# EAGLE design Main (EAGLE 9.6.0)
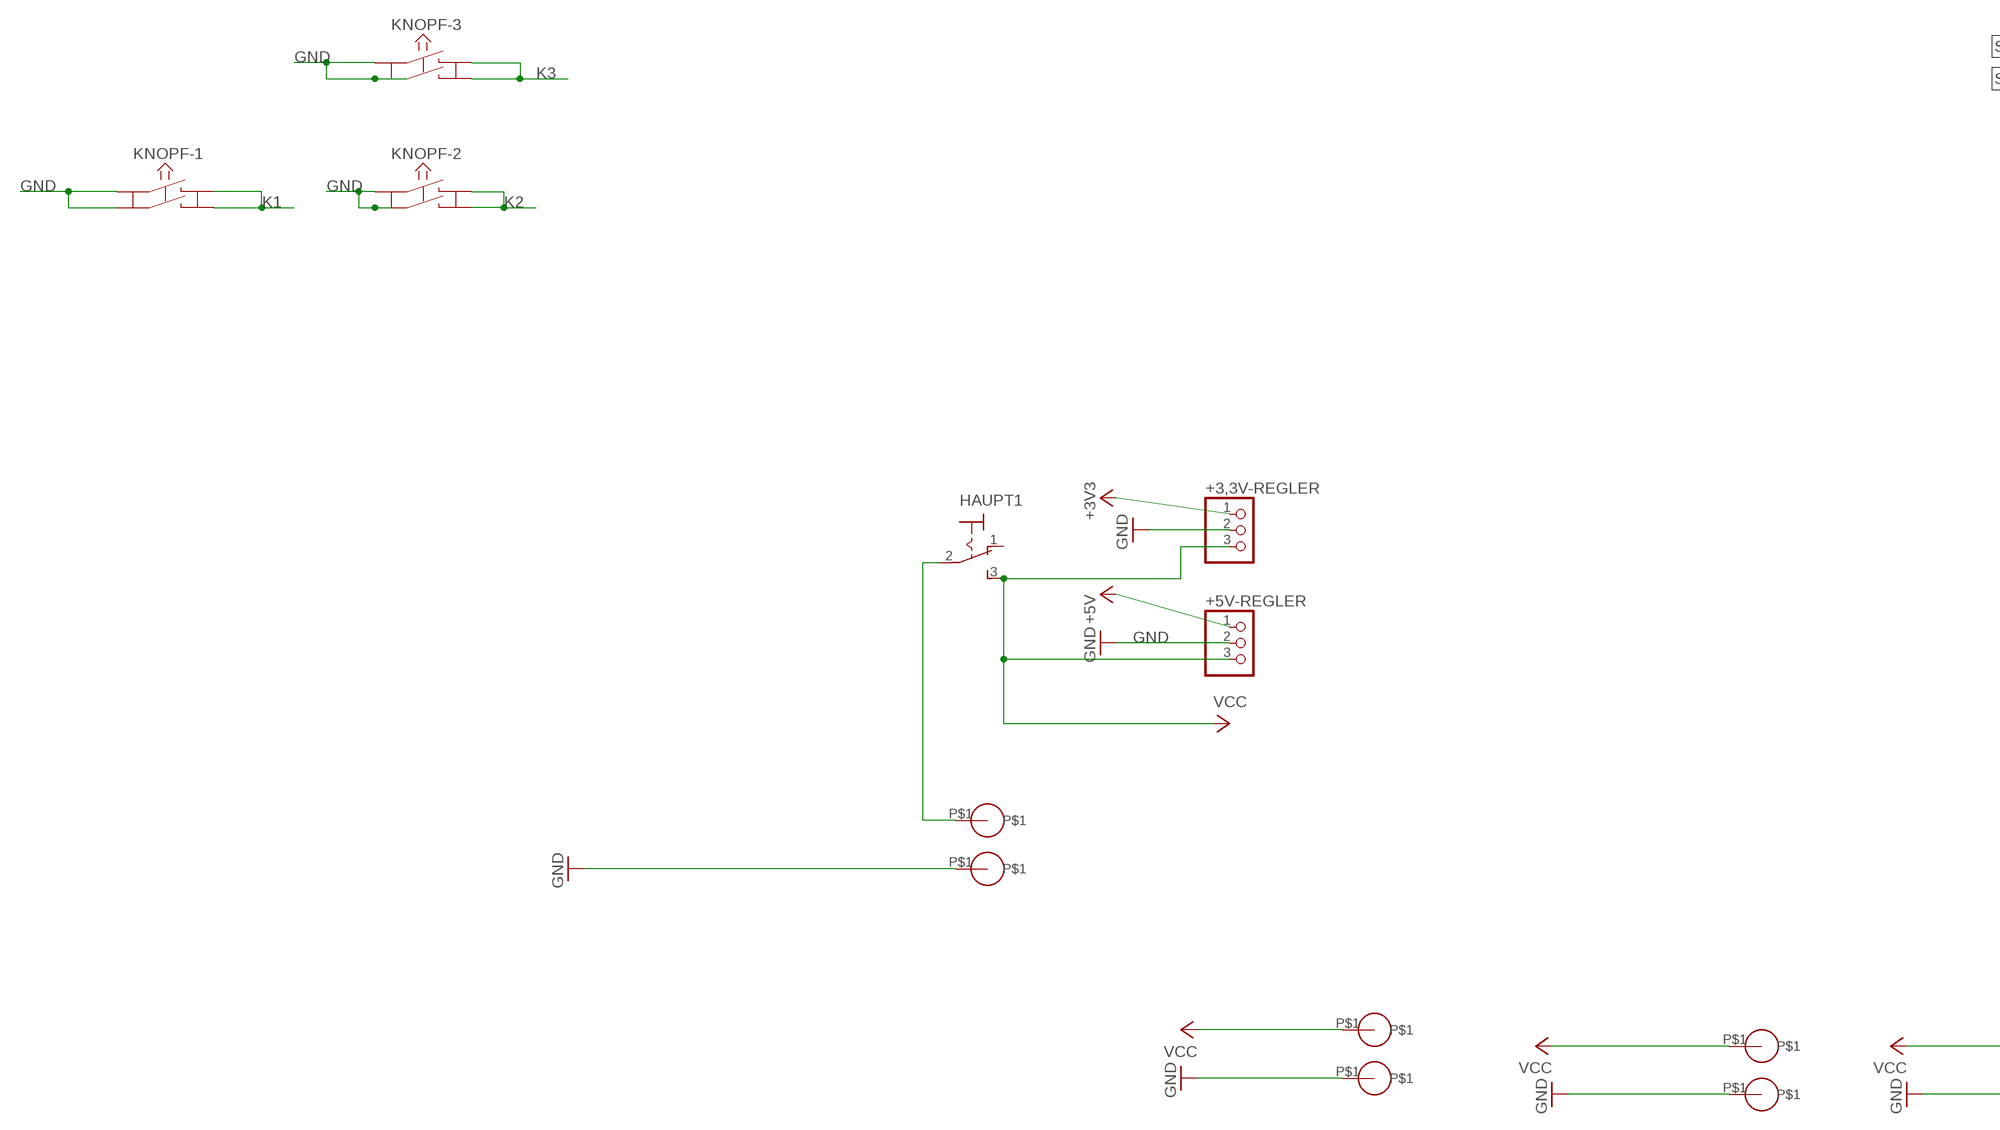
[diagram p0: schematic, sheet 1, part 1 of 3]
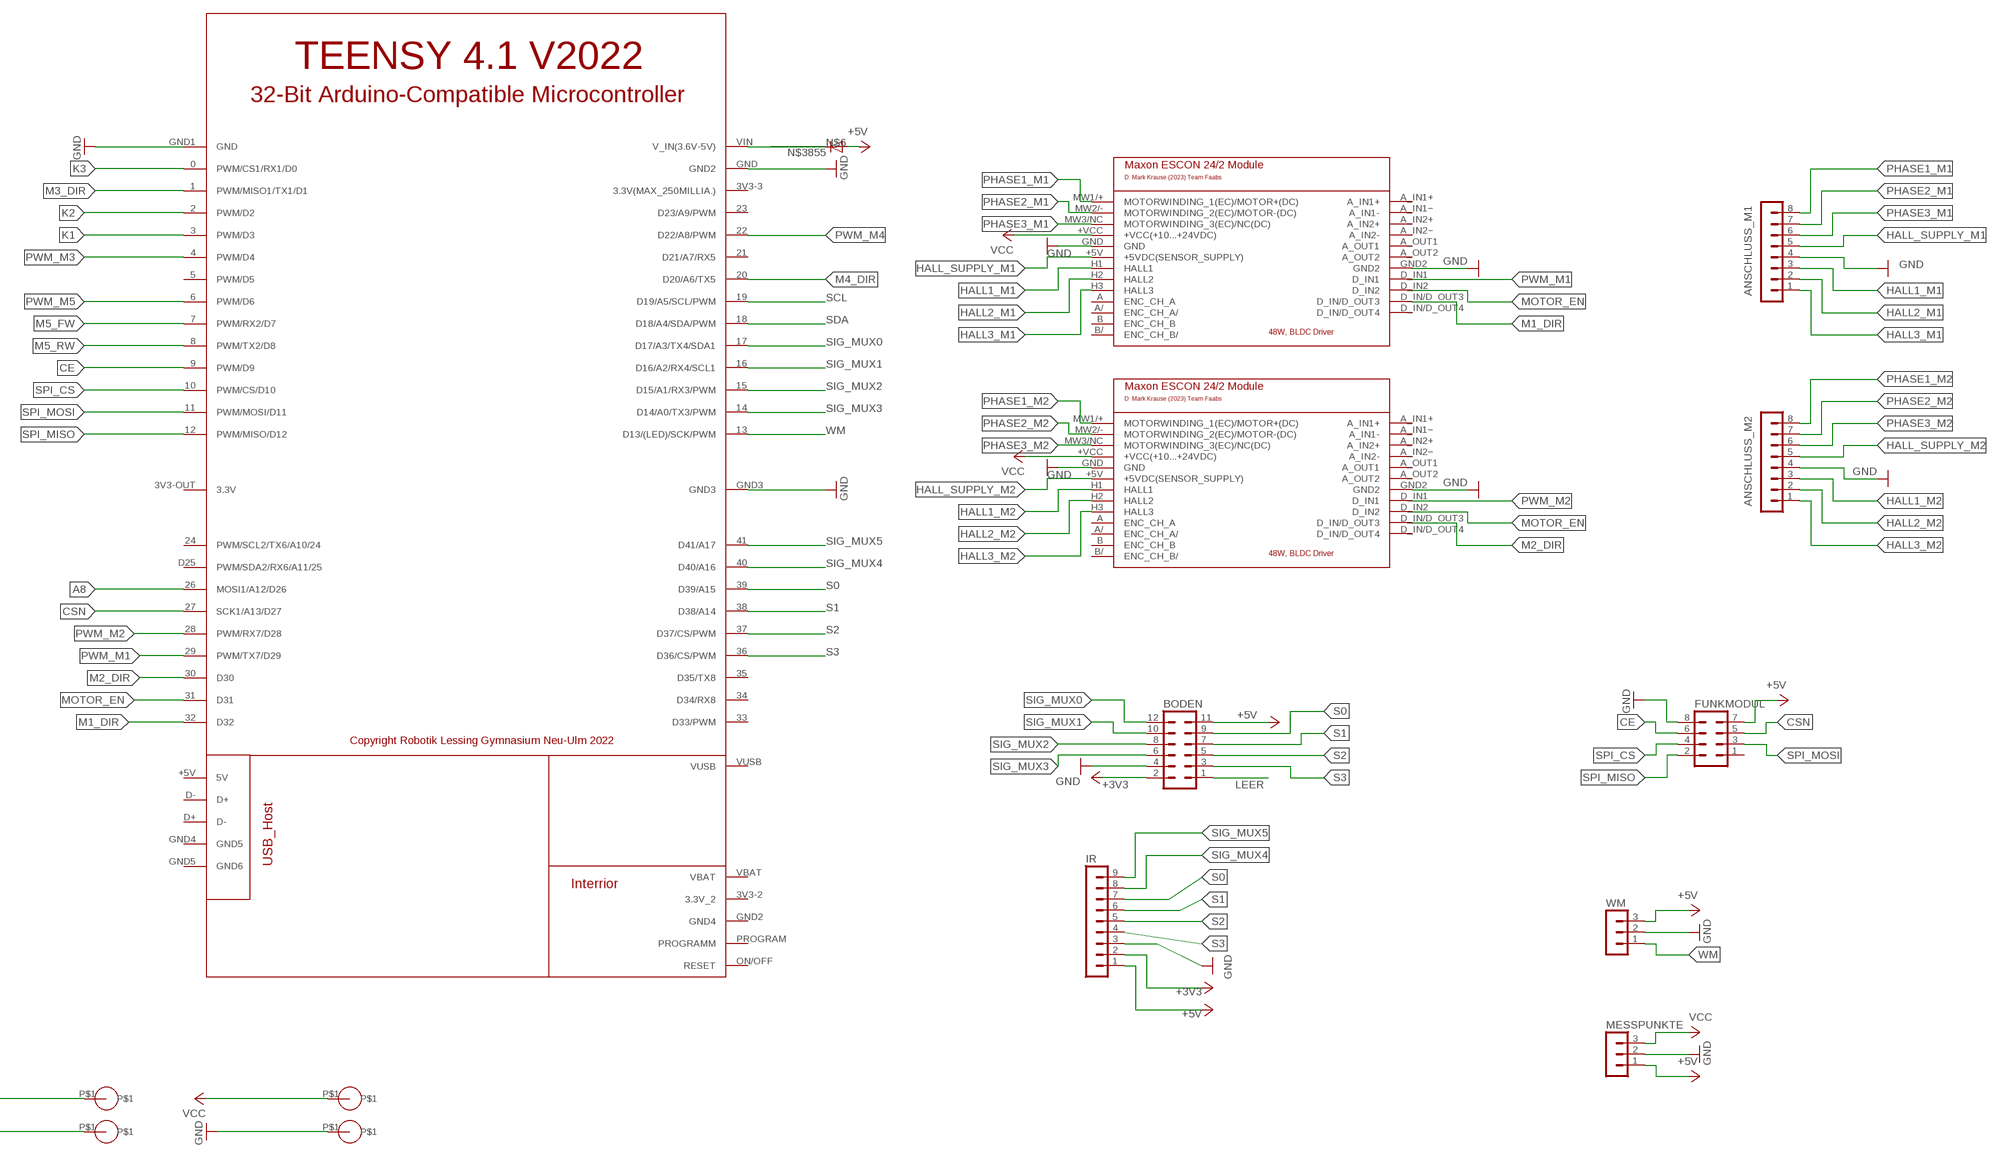
[diagram p1: schematic, sheet 1, part 2 of 3]
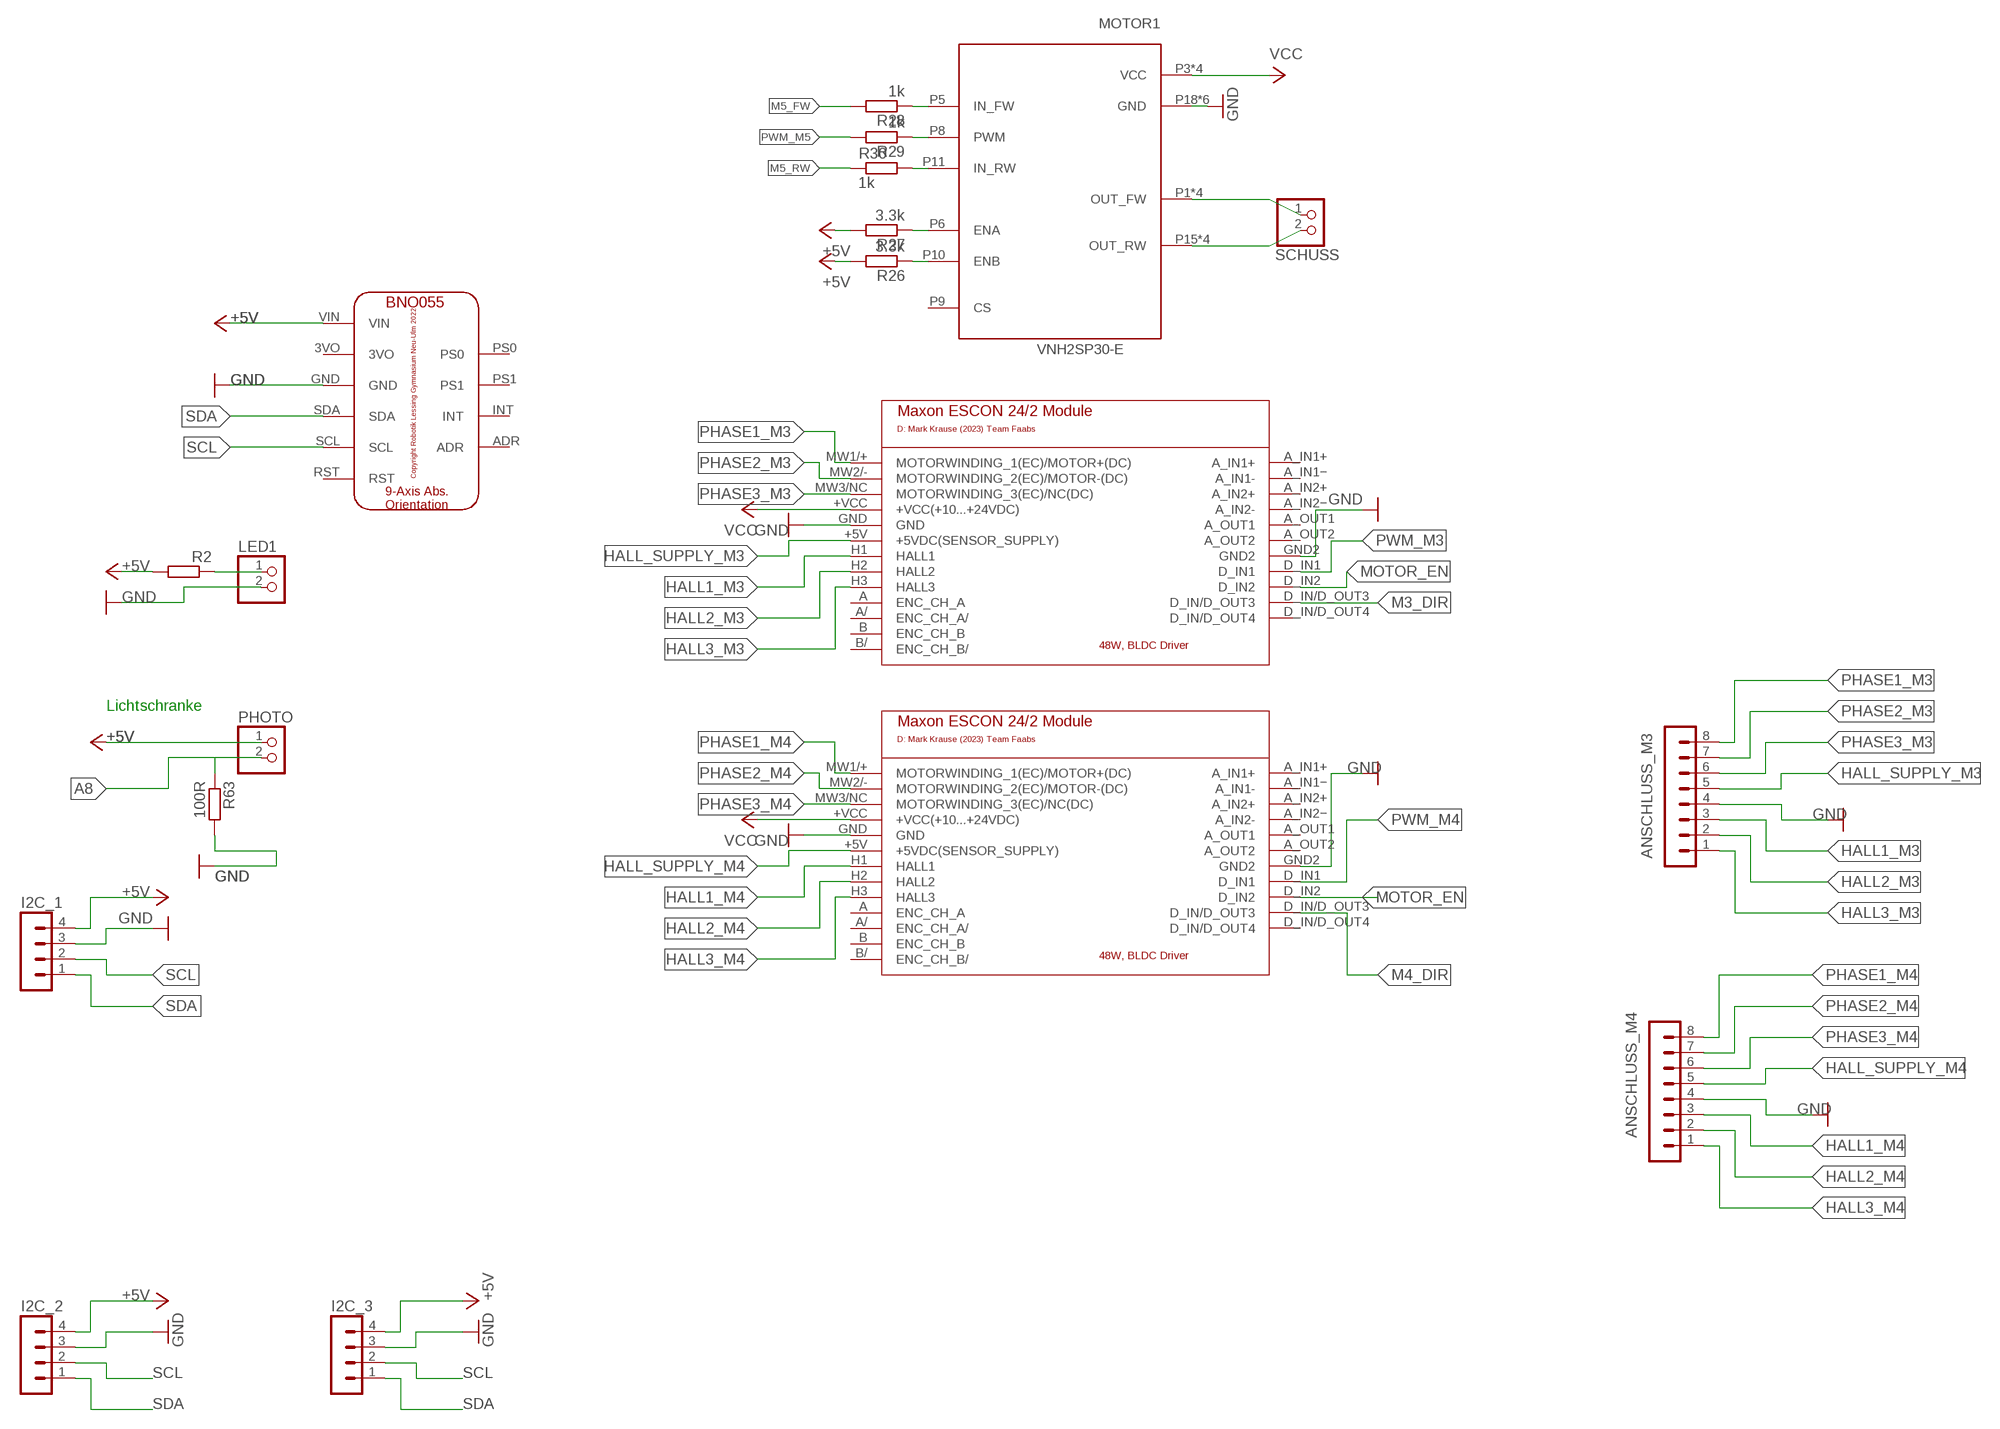
[diagram p2: schematic, sheet 1, part 3 of 3]

## Parts
+3,3V-REGLER  PINHD-1X3  [1X03]
+5V-REGLER  PINHD-1X3  [1X03]
ANSCHLUSS_M1  MA08-1  [MA08-1]
ANSCHLUSS_M2  MA08-1  [MA08-1]
ANSCHLUSS_M3  MA08-1  [MA08-1]
ANSCHLUSS_M4  MA08-1  [MA08-1]
BNO055  BNO055  [BNO055]
BODEN  MA06-2  [MA06-2]
FUNKMODUL  MA04-2  [MA04-2]
GND  PPAD  [PPAD]
GND10  PPAD  [PPAD]
GND11  PPAD  [PPAD]
GND35  PPAD  [PPAD]
GND37  PPAD  [PPAD]
HAUPT1  320-916  [320-916]
I2C_1  MA04-1  [MA04-1]
I2C_2  MA04-1  [MA04-1]
I2C_3  MA04-1  [MA04-1]
IR  MA09-1  [MA09-1]
KNOPF-1  KSM611A  [KSM611A]
KNOPF-2  KSM611A  [KSM611A]
KNOPF-3  KSM611A  [KSM611A]
LED1  PINHD-1X2  [1X02]
MAIN  PPAD  [PPAD]
MAIN1  PPAD  [PPAD]
MAIN2  PPAD  [PPAD]
MAIN3  PPAD  [PPAD]
MAIN4  PPAD  [PPAD]
MESSPUNKTE  MA03-1  [MA03-1]
MOTOR1  VNH2SP30-E  [MP-SO-30]
N$3855  DIODE-SMB  [SMB]
PHOTO  PINHD-1X2  [1X02]
R2  100R  R-EU_R1206  [R1206]
R26  3.3k  R-EU_R0805  [R0805]
R27  3.3k  R-EU_R0805  [R0805]
R28  1k  R-EU_R0805  [R0805]
R29  1k  R-EU_R0805  [R0805]
R30  1k  R-EU_R0805  [R0805]
R63  100R  R-EU_R0805  [R0805]
SCHUSS  PINHD-1X2  [1X02]
U$1  MAXON_ESCON24/2  [MAXON_ESCON24/2_MODULE]
U$2  TEENSY_4.1  [TEENSY_4.1]
U$3  MAXON_ESCON24/2  [MAXON_ESCON24/2_MODULE]
U$4  MAXON_ESCON24/2  [MAXON_ESCON24/2_MODULE]
U$5  MAXON_ESCON24/2  [MAXON_ESCON24/2_MODULE]
WM  MA03-1  [MA03-1]

## Nets
+3V3 [5v]: +3,3V-REGLER.1 BODEN.2 IR.2
+5V [5v]: +5V-REGLER.1 BNO055.VIN BODEN.11 FUNKMODUL.7 I2C_1.4 I2C_2.4 I2C_3.4 IR.1 MESSPUNKTE.1 N$3855.A PHOTO.1 R2.2 R26.2 R27.2 WM.3
A8: PHOTO.2 R63.1 U$2.26(MOSI1/A12/D26)
CE: FUNKMODUL.6 U$2.9(PWM/D9)
CSN: FUNKMODUL.5 U$2.27(SCK1/A13/D27)
GND: +3,3V-REGLER.2 +5V-REGLER.2 ANSCHLUSS_M1.4 ANSCHLUSS_M2.4 ANSCHLUSS_M3.4 ANSCHLUSS_M4.4 BNO055.GND BODEN.4 FUNKMODUL.8 GND10.P$1 GND11.P$1 GND35.P$1 GND37.P$1 GND.P$1 I2C_1.3 I2C_2.3 I2C_3.3 IR.3 KNOPF-1.A KNOPF-1.C KNOPF-2.A KNOPF-2.C KNOPF-3.A KNOPF-3.C LED1.2 MESSPUNKTE.2 MOTOR1.P18(GND) MOTOR1.P19(GND) MOTOR1.P20(GND) MOTOR1.P26(GND) MOTOR1.P27(GND) MOTOR1.P28(GND) R63.2 U$1.GND U$1.GND2 U$2.GND1(GND) U$2.GND3 U$2.GND(GND2) U$3.GND U$3.GND2 U$4.GND U$4.GND2 U$5.GND U$5.GND2 WM.2
HALL1_M1: ANSCHLUSS_M1.3 U$1.H1(HALL1)
HALL1_M2: ANSCHLUSS_M2.3 U$3.H1(HALL1)
HALL1_M3: ANSCHLUSS_M3.3 U$4.H1(HALL1)
HALL1_M4: ANSCHLUSS_M4.3 U$5.H1(HALL1)
HALL2_M1: ANSCHLUSS_M1.2 U$1.H2(HALL2)
HALL2_M2: ANSCHLUSS_M2.2 U$3.H2(HALL2)
HALL2_M3: ANSCHLUSS_M3.2 U$4.H2(HALL2)
HALL2_M4: ANSCHLUSS_M4.2 U$5.H2(HALL2)
HALL3_M1: ANSCHLUSS_M1.1 U$1.H3(HALL3)
HALL3_M2: ANSCHLUSS_M2.1 U$3.H3(HALL3)
HALL3_M3: ANSCHLUSS_M3.1 U$4.H3(HALL3)
HALL3_M4: ANSCHLUSS_M4.1 U$5.H3(HALL3)
HALL_SUPPLY_M1: ANSCHLUSS_M1.5 U$1.+5V(+5VDC(SENSOR_SUPPLY))
HALL_SUPPLY_M2: ANSCHLUSS_M2.5 U$3.+5V(+5VDC(SENSOR_SUPPLY))
HALL_SUPPLY_M3: ANSCHLUSS_M3.5 U$4.+5V(+5VDC(SENSOR_SUPPLY))
HALL_SUPPLY_M4: ANSCHLUSS_M4.5 U$5.+5V(+5VDC(SENSOR_SUPPLY))
K1: KNOPF-1.B KNOPF-1.D U$2.3(PWM/D3)
K2: KNOPF-2.B KNOPF-2.D U$2.2(PWM/D2)
K3: KNOPF-3.B KNOPF-3.D U$2.0(PWM/CS1/RX1/D0)
LEER: BODEN.1
M1_DIR: U$1.D_IN/D_OUT3 U$2.32(D32)
M2_DIR: U$2.30(D30) U$3.D_IN/D_OUT3
M3_DIR: U$2.1(PWM/MISO1/TX1/D1) U$4.D_IN/D_OUT3
M4_DIR: U$2.20(D20/A6/TX5) U$5.D_IN/D_OUT3
M5_FW: R28.2 U$2.7(PWM/RX2/D7)
M5_RW: R30.1 U$2.8(PWM/TX2/D8)
MOTOR_EN: U$1.D_IN2 U$2.31(D31) U$3.D_IN2 U$4.D_IN2 U$5.D_IN2
N$2: HAUPT1.2(P) MAIN.P$1
N$5: LED1.1 R2.1
N$6: N$3855.C U$2.VIN(V_IN(3.6V-5V))
N$43: MOTOR1.P5(IN_FW) R28.1
N$44: MOTOR1.P6(ENA) R27.1
N$45: MOTOR1.P10(ENB) R26.1
N$46: MOTOR1.P8(PWM) R29.1
N$47: MOTOR1.P11(IN_RW) R30.2
N$49 [power]: MOTOR1.P1(OUT_FW) MOTOR1.P25(OUT_FW) MOTOR1.P30(OUT_FW) MOTOR1.S2(OUT_FW) SCHUSS.1
N$50 [power]: MOTOR1.P15(OUT_RW) MOTOR1.P16(OUT_RW) MOTOR1.P21(OUT_RW) MOTOR1.S3(OUT_RW) SCHUSS.2
PHASE1_M1: ANSCHLUSS_M1.8 U$1.MW1/+(MOTORWINDING_1(EC)/MOTOR+(DC))
PHASE1_M2: ANSCHLUSS_M2.8 U$3.MW1/+(MOTORWINDING_1(EC)/MOTOR+(DC))
PHASE1_M3: ANSCHLUSS_M3.8 U$4.MW1/+(MOTORWINDING_1(EC)/MOTOR+(DC))
PHASE1_M4: ANSCHLUSS_M4.8 U$5.MW1/+(MOTORWINDING_1(EC)/MOTOR+(DC))
PHASE2_M1: ANSCHLUSS_M1.7 U$1.MW2/-(MOTORWINDING_2(EC)/MOTOR-(DC))
PHASE2_M2: ANSCHLUSS_M2.7 U$3.MW2/-(MOTORWINDING_2(EC)/MOTOR-(DC))
PHASE2_M3: ANSCHLUSS_M3.7 U$4.MW2/-(MOTORWINDING_2(EC)/MOTOR-(DC))
PHASE2_M4: ANSCHLUSS_M4.7 U$5.MW2/-(MOTORWINDING_2(EC)/MOTOR-(DC))
PHASE3_M1: ANSCHLUSS_M1.6 U$1.MW3/NC(MOTORWINDING_3(EC)/NC(DC))
PHASE3_M2: ANSCHLUSS_M2.6 U$3.MW3/NC(MOTORWINDING_3(EC)/NC(DC))
PHASE3_M3: ANSCHLUSS_M3.6 U$4.MW3/NC(MOTORWINDING_3(EC)/NC(DC))
PHASE3_M4: ANSCHLUSS_M4.6 U$5.MW3/NC(MOTORWINDING_3(EC)/NC(DC))
PWM_M1: U$1.D_IN1 U$2.29(PWM/TX7/D29)
PWM_M2: U$2.28(PWM/RX7/D28) U$3.D_IN1
PWM_M3: U$2.4(PWM/D4) U$4.D_IN1
PWM_M4: U$2.22(D22/A8/PWM) U$5.D_IN1
PWM_M5: R29.2 U$2.6(PWM/D6)
S0: BODEN.9 IR.7 U$2.39(D39/A15)
S1: BODEN.7 IR.6 U$2.38(D38/A14)
S2: BODEN.5 IR.5 U$2.37(D37/CS/PWM)
S3: BODEN.3 IR.4 U$2.36(D36/CS/PWM)
SCL: BNO055.SCL I2C_1.2 I2C_2.2 I2C_3.2 U$2.19(D19/A5/SCL/PWM)
SDA: BNO055.SDA I2C_1.1 I2C_2.1 I2C_3.1 U$2.18(D18/A4/SDA/PWM)
SIG_MUX0: BODEN.12 U$2.17(D17/A3/TX4/SDA1)
SIG_MUX1: BODEN.10 U$2.16(D16/A2/RX4/SCL1)
SIG_MUX2: BODEN.8 U$2.15(D15/A1/RX3/PWM)
SIG_MUX3: BODEN.6 U$2.14(D14/A0/TX3/PWM)
SIG_MUX4: IR.8 U$2.40(D40/A16)
SIG_MUX5: IR.9 U$2.41(D41/A17)
SPI_CS: FUNKMODUL.4 U$2.10(PWM/CS/D10)
SPI_MISO: FUNKMODUL.2 U$2.12(PWM/MISO/D12)
SPI_MOSI: FUNKMODUL.3 U$2.11(PWM/MOSI/D11)
VCC: +3,3V-REGLER.3 +5V-REGLER.3 HAUPT1.3(S) MAIN1.P$1 MAIN2.P$1 MAIN3.P$1 MAIN4.P$1 MESSPUNKTE.3 MOTOR1.P3(VCC) MOTOR1.P13(VCC) MOTOR1.P23(VCC) MOTOR1.S1(VCC) U$1.+VCC(+VCC(+10...+24VDC)) U$3.+VCC(+VCC(+10...+24VDC)) U$4.+VCC(+VCC(+10...+24VDC)) U$5.+VCC(+VCC(+10...+24VDC))
WM: U$2.13(D13/(LED)/SCK/PWM) WM.1
Unconnected: BNO055.3VO BNO055.ADR BNO055.INT BNO055.PS0 BNO055.PS1 BNO055.RST FUNKMODUL.1 HAUPT1.1(O) MOTOR1.P9(CS) U$1.A(ENC_CH_A) U$1.A/(ENC_CH_A/) U$1.A_IN1+ U$1.A_IN1−(A_IN1-) U$1.A_IN2+ U$1.A_IN2−(A_IN2-) U$1.A_OUT1 U$1.A_OUT2 U$1.B(ENC_CH_B) U$1.B/(ENC_CH_B/) U$1.D_IN/D_OUT4 U$2.3V3-2(3.3V_2) U$2.3V3-3(3.3V(MAX_250MILLIA.)) U$2.3V3-OUT(3.3V) U$2.5(PWM/D5) U$2.21(D21/A7/RX5) U$2.23(D23/A9/PWM) U$2.24(PWM/SCL2/TX6/A10/24) U$2.33(D33/PWM) U$2.34(D34/RX8) U$2.35(D35/TX8) U$2.+5V(5V) U$2.D25(PWM/SDA2/RX6/A11/25) U$2.D+(D-) U$2.D-(D+) U$2.GND2(GND4) U$2.GND4(GND5) U$2.GND5(GND6) U$2.ON/OFF(RESET) U$2.PROGRAM(PROGRAMM) U$2.VBAT U$2.VUSB U$3.A(ENC_CH_A) U$3.A/(ENC_CH_A/) U$3.A_IN1+ U$3.A_IN1−(A_IN1-) U$3.A_IN2+ U$3.A_IN2−(A_IN2-) U$3.A_OUT1 U$3.A_OUT2 U$3.B(ENC_CH_B) U$3.B/(ENC_CH_B/) U$3.D_IN/D_OUT4 U$4.A(ENC_CH_A) U$4.A/(ENC_CH_A/) U$4.A_IN1+ U$4.A_IN1−(A_IN1-) U$4.A_IN2+ U$4.A_IN2−(A_IN2-) U$4.A_OUT1 U$4.A_OUT2 U$4.B(ENC_CH_B) U$4.B/(ENC_CH_B/) U$4.D_IN/D_OUT4 U$5.A(ENC_CH_A) U$5.A/(ENC_CH_A/) U$5.A_IN1+ U$5.A_IN1−(A_IN1-) U$5.A_IN2+ U$5.A_IN2−(A_IN2-) U$5.A_OUT1 U$5.A_OUT2 U$5.B(ENC_CH_B) U$5.B/(ENC_CH_B/) U$5.D_IN/D_OUT4

## Notes on the sheet
- Lichtschranke

## Library data of the parts
+3,3V-REGLER +5V-REGLER = pinhead:PINHD-1X3: PIN HEADER
ANSCHLUSS_M1-ANSCHLUSS_M4 = con-lstb:MA08-1: PIN HEADER; OC_FARNELL: unknown; OC_NEWARK: unknown
BNO055 = BNO055:BNO055: BNO055 A libary to mount the BNO055 Board direct to your pcb using pinheads
BODEN = con-lstb:MA06-2: PIN HEADER; OC_FARNELL: unknown; OC_NEWARK: unknown
FUNKMODUL = con-lstb:MA04-2: PIN HEADER; OC_FARNELL: unknown; OC_NEWARK: unknown
GND GND10 GND11 GND35 GND37 MAIN MAIN1-MAIN4 = motor-driver:PPAD
HAUPT1 = switch:320-916: TOGGLE SWITCH distributor RS Components
I2C_1-I2C_3 = con-lstb:MA04-1: PIN HEADER; OC_FARNELL: unknown; OC_NEWARK: unknown
IR = con-lstb:MA09-1: PIN HEADER; OC_FARNELL: unknown; OC_NEWARK: unknown
KNOPF-1-KNOPF-3 = schalter_taster:KSM611A
LED1 PHOTO SCHUSS = pinhead:PINHD-1X2: PIN HEADER
MESSPUNKTE WM = con-lstb:MA03-1: PIN HEADER; OC_FARNELL: unknown; OC_NEWARK: unknown
MOTOR1 = motor-driver:VNH2SP30-E: VNH2SP30-E full bridge motor driver 40V-30A
N$3855 = diode:DIODE-: DIODE
R2 R26-R30 R63 = rcl:R-EU_: RESISTOR, European symbol
U$1 U$3-U$5 = Motortreiber_MaxonESCON24-2:MAXON_ESCON24/2: designed by Mark Krause from Team Faabs, technulgy Lessing-Gymnasium Neu-ulm, (Dec. 2023)
U$2 = Teensy41:TEENSY_4.1

## Net classes
1 5v: width 0.813 mm, drill 0.8 mm
2 power: width 0.406 mm, drill 0.5 mm, clearance 0.15 mm

## Board
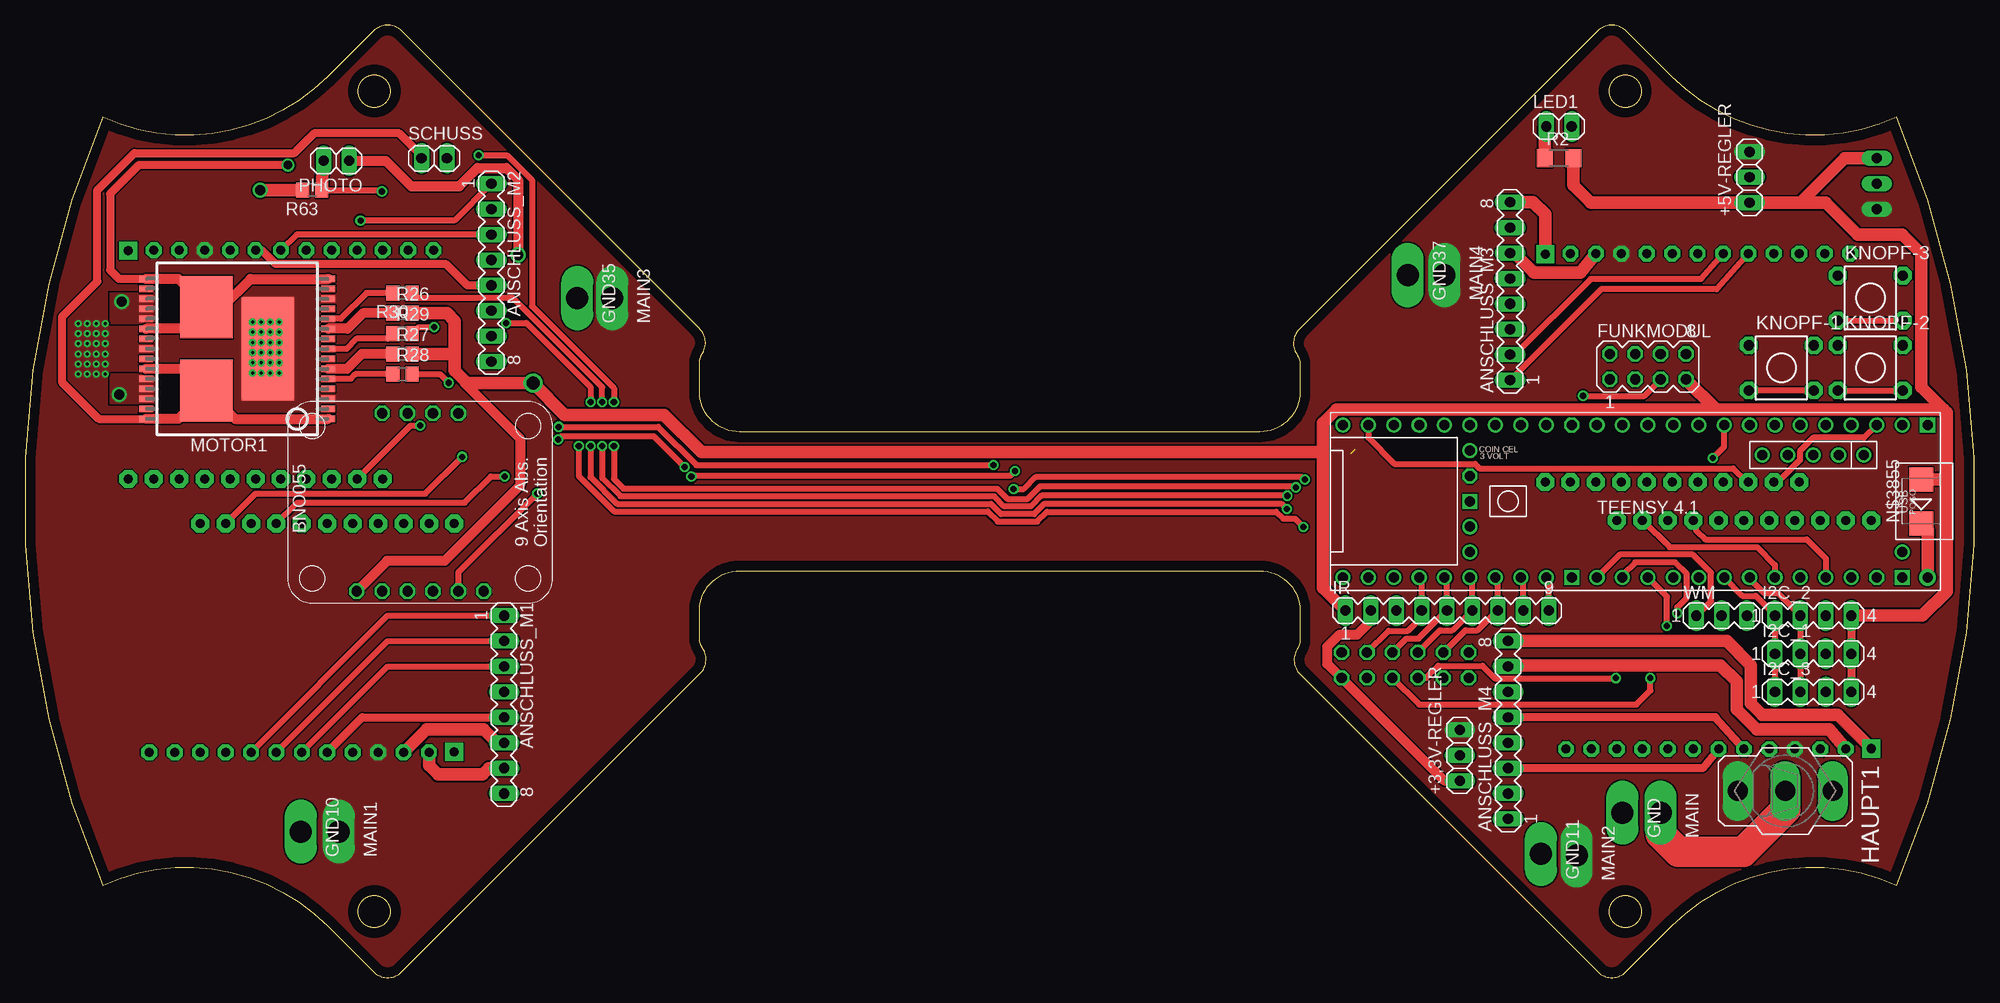
[diagram p3: board, top side]
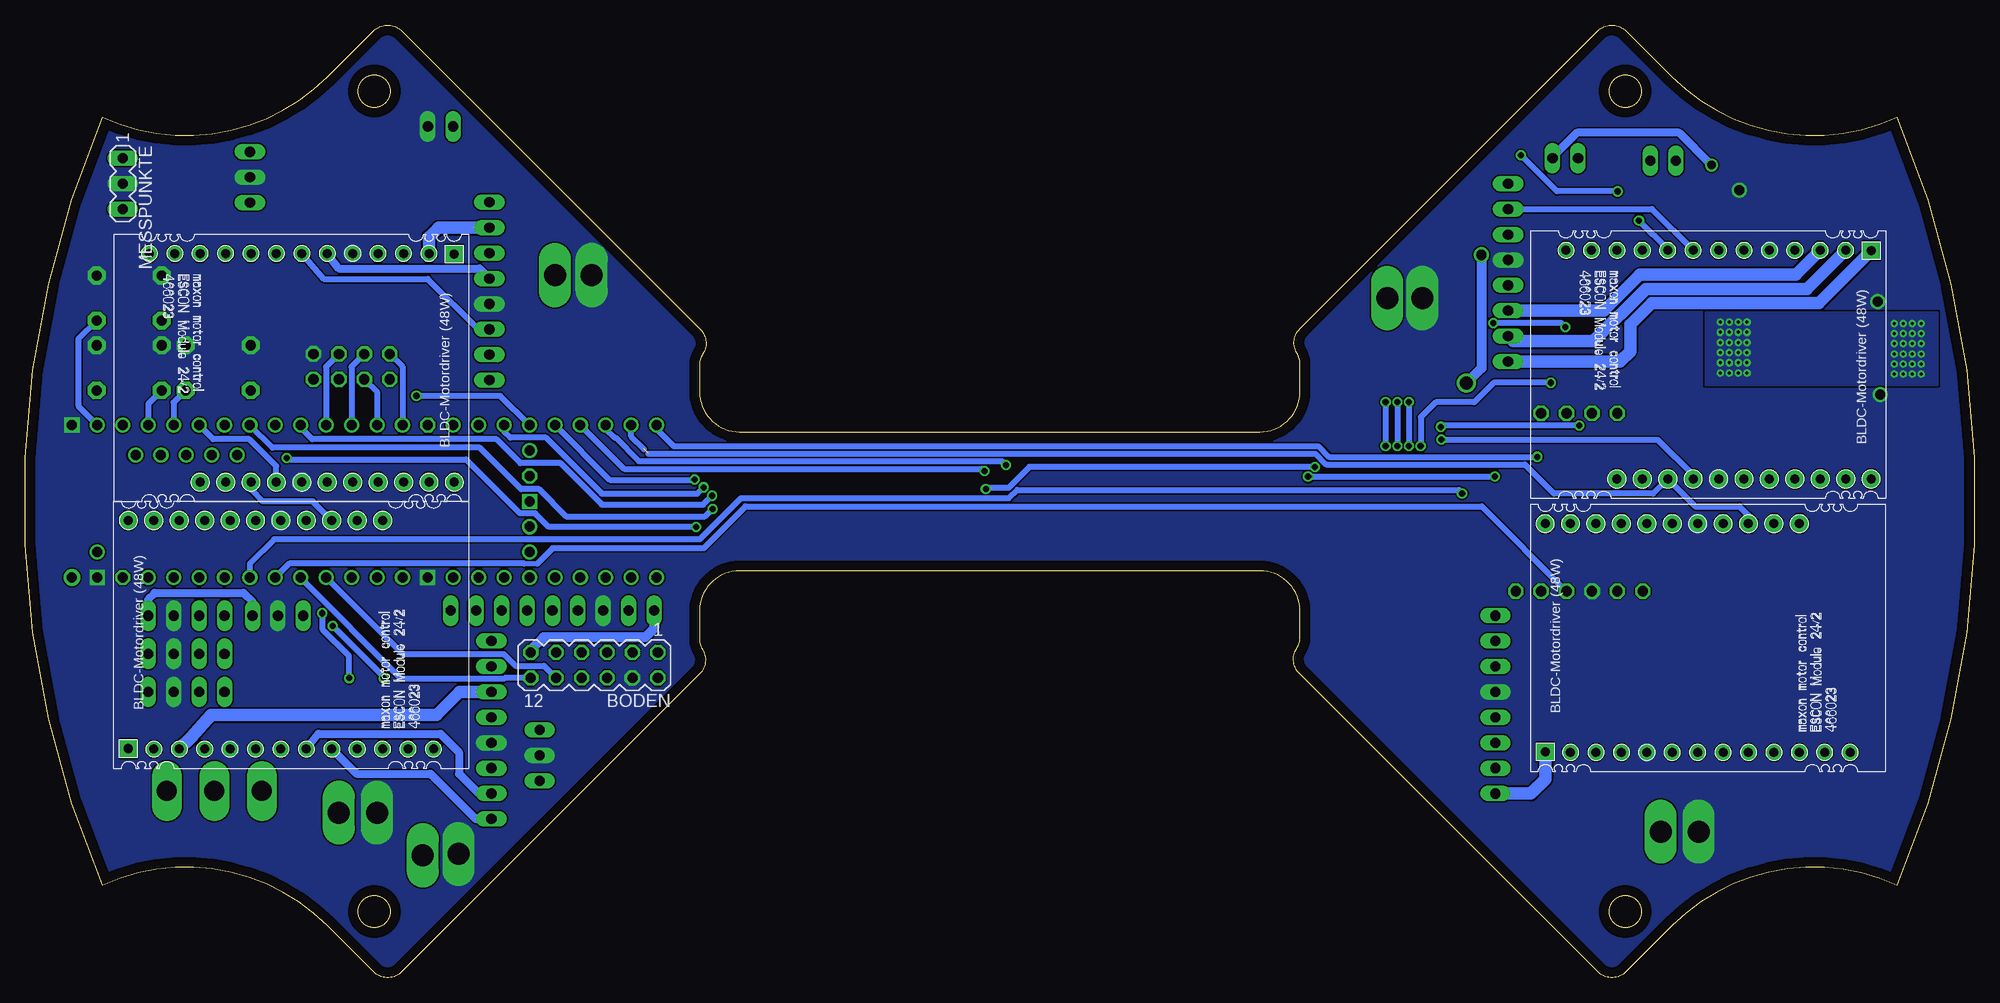
[diagram p4: board, bottom side, seen from below]

Size 194.8 x 95.21 mm. Coordinates in mm from the lower left corner, seen from the top.
Outline: 159.98,0.58 arc-90 157.15,0.58 127.4,30.33 arc-76 127.11,32.79 arc31 127.4,33.83 127.4,36.66 arc90 123.4,40.66 71.4,40.66 arc90 67.4,36.66 67.4,33.99 arc33 67.73,32.9 arc-78 67.46,30.4 37.65,0.58 arc-90 34.82,0.58 30.23,5.18 arc70 7.77,9.23 arc-46 7.77,85.98 arc70 30.23,90.03 34.82,94.63 arc-90 37.65,94.63 67.4,64.88 arc-76 67.69,62.42 arc31 67.4,61.38 67.4,58.55 arc90 71.4,54.55 123.4,54.55 arc90 127.4,58.55 127.4,61.22 arc33 127.08,62.31 arc-78 127.34,64.82 157.15,94.63 arc-90 159.98,94.63 164.58,90.03 arc70 187.03,85.98 arc-46 187.03,9.23 arc70 164.58,5.18 159.98,0.58
Outline: 159.98,0.58 159.98,0.58
Outline: circle at 159.9,6.61 radius 1.6
Outline: circle at 34.9,6.61 radius 1.6
Outline: circle at 159.9,88.61 radius 1.6
Outline: circle at 34.9,88.61 radius 1.6
Copper layers (1*16): Top 0.035mm / dielectric 1.5mm / Bottom 0.035mm
Design rules "default": minimum track width 6mil, minimum drill 0.35mm, track to track 6mil, track to pad 6mil, pad to pad 6mil, via to via 6mil, smd to smd 6mil, copper to edge 40mil, drill to drill 6mil, minimum pad ring 10mil, minimum via ring 8mil, stop-mask expansion 4mil, vias tented up to drill 0mil, thermal gap 10mil

### Footprints (pad centres in the part's own frame; a part is rotated, then mirrored left to right if it is on the bottom)
1X03 = drill 1.016 long: 1 -2.54,0; 2 0,0; 3 2.54,0
MA08-1 = drill 1.016 long: 1 -8.89,0; 2 -6.35,0; 3 -3.81,0; 4 -1.27,0; 5 1.27,0; 6 3.81,0; 7 6.35,0; 8 8.89,0
BNO055 = drill 1.016 octagon: 3VO -8.99,3.81; ADR 8.79,-3.81; GND -8.99,1.27; INT 8.79,-1.27; PS0 8.79,3.81; PS1 8.79,1.27; RST -8.99,-6.35; SCL -8.99,-3.81; SDA -8.99,-1.27; VIN -8.99,6.35
MA06-2 = drill 1.016 octagon: 1 -6.35,-1.27; 2 -6.35,1.27; 3 -3.81,-1.27; 4 -3.81,1.27; 5 -1.27,-1.27; 6 -1.27,1.27; 7 1.27,-1.27; 8 1.27,1.27; 9 3.81,-1.27; 10 3.81,1.27; 11 6.35,-1.27; 12 6.35,1.27
MA04-2 = drill 1.016 octagon: 1 -3.81,-1.27; 2 -3.81,1.27; 3 -1.27,-1.27; 4 -1.27,1.27; 5 1.27,-1.27; 6 1.27,1.27; 7 3.81,-1.27; 8 3.81,1.27
PPAD = drill 2.2 long: P$1 0,0
320-916 = drill 2.007 long: 1 0,4.75; 2 0,0; 3 0,-4.75
MA04-1 = drill 1.016 long: 1 -3.81,0; 2 -1.27,0; 3 1.27,0; 4 3.81,0
MA09-1 = drill 1.016 long: 1 -10.16,0; 2 -7.62,0; 3 -5.08,0; 4 -2.54,0; 5 0,0; 6 2.54,0; 7 5.08,0; 8 7.62,0; 9 10.16,0
KSM611A = drill 1.016 pad 1.778 octagon: A -3.25,2.25; B -3.25,-2.25; C 3.25,2.25; D 3.25,-2.25
1X02 = drill 1.016 long: 1 -1.27,0; 2 1.27,0
MA03-1 = drill 1.016 long: 1 -2.54,0; 2 0,0; 3 2.54,0
MP-SO-30 = smd 0.65 x 1.4: NC1 -6,9.1; NC2 -1,9.1; NC3 1,9.1; NC4 6,9.1; NC5 -6,-9.1; NC6 -4,-9.1; NC7 -1,-9.1; NC8 4,-9.1; NC9 6,-9.1; P1 -7,-9.1; P3 -5,-9.1; P5 -3,-9.1; P6 -2,-9.1; P8 0,-9.1; P9 1,-9.1; P10 2,-9.1; P11 3,-9.1; P13 5,-9.1; P15 7,-9.1; P16 7,9.1; P18 5,9.1; P19 4,9.1; P20 3,9.1; P21 2,9.1; P23 0,9.1; P25 -2,9.1; P26 -3,9.1; P27 -4,9.1; P28 -5,9.1; P30 -7,9.1 | smd 10.3 x 5.25: S1 0,-3.05 | smd 6.23 x 5.25: S2 -4.165,3.05; S3 4.165,3.05
SMB = smd 2.4 x 2.4: A 2.2,0; C -2.2,0
R1206 = smd 1.6 x 1.803: 1 -1.422,0; 2 1.422,0
R0805 = smd 1.3 x 1.5: 1 -0.95,0; 2 0.95,0
MAXON_ESCON24/2_MODULE = drill 0.9 pad 1.575 octagon: +5V 1.905,-14.2; +VCC 1.905,-9.12; A 1.905,-24.36; A/ 1.905,-26.9; B 1.905,-29.44; B/ 1.905,-31.98; GND 1.905,-11.66; H1 1.905,-16.74; H2 1.905,-19.28; H3 1.905,-21.82; MW2/- 1.905,-4.04; MW3/NC 1.905,-6.58 | drill 0.9 pad 1.8 octagon: A_IN1+ 24.765,-1.5; A_IN1− 24.765,-4.04; A_IN2+ 24.765,-6.58; A_IN2− 24.765,-9.12; A_OUT1 24.765,-11.66; A_OUT2 24.765,-14.2; D_IN1 24.765,-19.28; D_IN2 24.765,-21.82; D_IN/D_OUT3 24.765,-24.36; D_IN/D_OUT4 24.765,-26.9; GND2 24.765,-16.74 | drill 0.9 pad 1.8 square: MW1/+ 1.95,-1.5
TEENSY_4.1 = drill 1: 0 -26.67,-7.62; 1 -24.13,-7.62; 2 -21.59,-7.62; 3 -19.05,-7.62; 4 -16.51,-7.62; 5 -13.97,-7.62; 6 -11.43,-7.62; 7 -8.89,-7.62; 8 -6.35,-7.62; 9 -3.81,-7.62; 10 -1.27,-7.62; 11 1.27,-7.62; 12 3.81,-7.62; 13 3.81,7.62; 14 1.27,7.62; 15 -1.27,7.62; 16 -3.81,7.62; 17 -6.35,7.62; 18 -8.89,7.62; 19 -11.43,7.62; 20 -13.97,7.62; 21 -16.51,7.62; 22 -19.05,7.62; 23 -21.59,7.62; 24 8.89,-7.62; 26 13.97,-7.62; 27 16.51,-7.62; 28 19.05,-7.62; 29 21.59,-7.62; 30 24.13,-7.62; 31 26.67,-7.62; 32 29.21,-7.62; 33 29.21,7.62; 34 26.67,7.62; 35 24.13,7.62; 36 21.59,7.62; 37 19.05,7.62; 38 16.51,7.62; 39 13.97,7.62; 40 11.43,7.62; 41 8.89,7.62; +5V -22.86,-4.62; D25 11.43,-7.62; D+ -17.78,-4.62; D- -20.32,-4.62; GND4 -15.24,-4.62; GND5 -12.7,-4.62; ON/OFF 16.51,5.08; PROGRAM 16.51,2.54; VBAT 16.51,-5.08; VUSB -26.67,5.08 | drill 1 octagon: 3V3-2 16.51,-2.54; 3V3-3 -24.13,7.62; 3V3-OUT 6.35,-7.62 | drill 1 square: GND -26.67,7.62; GND1 -29.21,-7.62; GND2 16.51,0; GND3 6.35,7.62 | drill 1 pad 1.676: VIN -29.21,7.62

### Placement (x,y rotation side)
+3,3V-REGLER  143.38,22.21 90 top
+5V-REGLER  172.33,79.99 90 top
ANSCHLUSS_M1  47.87,27.29 270 top
ANSCHLUSS_M2  46.6,70.47 270 top
ANSCHLUSS_M3  148.4,68.61 90 top
ANSCHLUSS_M4  148.2,24.75 90 top
BNO055  39.49,47.61 90 top
BODEN  137.91,31.22 180 bottom
FUNKMODUL  162.17,61.07 0 top
GND  159.63,16.49 0 top
GND10  27.55,14.59 0 top
GND11  151.48,12.35 0 top
GND35  55.19,67.93 0 top
GND37  138.17,70.21 0 top
HAUPT1  175.89,18.65 270 top
I2C_1  178.68,32.37 0 top
I2C_2  178.68,36.18 0 top
I2C_3  178.68,28.56 0 top
IR  142.11,36.68 0 top
KNOPF-1  175.51,60.94 0 top
KNOPF-2  184.4,60.94 0 top
KNOPF-3  184.4,67.93 0 top
LED1  153.28,85.07 0 top
MAIN  163.44,16.49 0 top
MAIN1  31.36,14.59 0 top
MAIN2  155.06,12.22 0 top
MAIN3  58.67,67.93 0 top
MAIN4  141.85,70.21 0 top
MESSPUNKTE  185.03,79.36 270 bottom
MOTOR1  21.2,62.85 90 top
N$3855  189.48,47.61 90 top
PHOTO  31.11,81.64 180 top
R2  153.28,81.9 0 top
R26  37.71,66.4 0 top
R27  37.71,62.34 0 top
R28  37.71,60.31 0 top
R29  37.71,64.37 0 top
R30  37.71,68.43 180 top
R63  28.69,78.72 180 top
SCHUSS  40.89,81.9 0 top
U$1  44.4,20.61 90 bottom
U$2  160.9,47.61 180 top
U$3  8.83,74.61 270 bottom
U$4  150.4,74.28 270 bottom
U$5  185.97,20.94 90 bottom
WM  169.54,36.18 0 top

### Tracks (layer width: path | path; a pad name or v marks a point on that pad's centre or on a via)
+3V3
  Top 1.016: +3,3V-REGLER.1 141.85,19.67 BODEN.2 131.53,29.95 130.14,31.35 130.14,33.08 131.36,34.3 133.12,34.3 134.49,35.66 IR.2
+5V  (via drill 1.02, 1.27)
  Top 0.813: I2C_2.4 I2C_1.4 I2C_3.4
  Top 1.016: PHOTO.1 36.06,81.64 38.6,79.1 43.39,79.1 45.2,80.91 48.1,80.91 49.27,79.74 v49.27,72.24 | 43.94,59.42 46.35,59.42 46.4,59.42 | 44.19,59.42 44.19,59.16 49.47,53.88 49.47,49.18 41.95,41.66 36.19,41.66 BNO055.VIN
  Top 1.27: 177.41,77.45 +5V-REGLER.1 156.46,77.45 154.7,79.2 R2.2 | MESSPUNKTE.1 181.86,81.9 177.41,77.45 | 191.75,56.77 192.02,56.5 192.02,49.89 | FUNKMODUL.7 169.01,56.77 | 191.75,56.77 169.01,56.77 | 177.41,77.45 179.95,77.45 183.13,74.28 187.57,74.28 189.48,72.37 189.48,59.04 191.75,56.77 | I2C_2.4 189.6,36.18 192.02,38.59 192.02,49.89 | 192.02,49.89 191.93,49.81 N$3855.A | 169.01,56.77 131.02,56.77 129.7,55.44 129.7,52.46 | R27.2 42.89,62.34 42.92,62.31 | 42.92,62.31 42.92,65.64 42.16,66.4 R26.2 | 42.92,62.31 42.92,60.69 44.19,59.42 46.35,59.42 v50.77,59.42 53.94,56.24 63.87,56.24 67.6,52.52 129.64,52.52 129.7,52.46 | 129.7,52.46 129.7,38.93 IR.1
  Bottom 0.813: I2C_2.4 182.49,37.83 181.86,38.46 172.97,38.46 172.08,37.57 WM.3
  Bottom 1.016: IR.1 131.95,34.91 132.83,34.02 142.99,34.02 144.26,32.75 BODEN.11 | v50.77,59.42 49.27,60.92 v49.27,72.24
A8  (via drill 0.61, 0.65)
  Top 0.61: R63.1 35.55,78.72 v35.68,78.59 | v58.84,53.12 58.84,49.84 59.81,48.88 97.15,48.88 98.16,47.86 100.2,47.86 101.47,49.13 126.87,49.13 v126.99,49 | v45.33,82.2 48.17,82.2 50.67,79.71 50.67,67.1 58.84,58.92 v58.84,57.54
  Top 1.27: R63.1 29.78,81.58 PHOTO.2
  Bottom 0.61: v35.68,78.59 41.72,78.59 v45.33,82.2 | v58.84,57.54 v58.84,53.12 | v126.99,49 127.63,48.37 137.15,48.37 142.74,53.96 146.3,53.96 146.93,54.59 U$2.26
CE
  Bottom 0.61: FUNKMODUL.6 164.71,61.07 U$2.9
CSN  (via drill 0.65)
  Top 0.61: v155.69,58.15 161.79,58.15 FUNKMODUL.5
  Bottom 0.61: U$2.27 147.31,58.15 v155.69,58.15
GND  (via drill 1)
  Top 1.27: R63.2 v23.49,78.72
  other vias: 9.39,58.27 9.64,67.55
  pour Bottom (rank 5, no thermals): 8.63,97.9 189.6,97.9 210.18,77.32 210.18,9.51 194.56,-6.11 4.06,-6.11 1.01,-3.07 -13.85,11.79 -13.85,14.08 -13.85,75.42 -9.66,79.61
  pour Top (no thermals): 13.2,65.39 8.5,65.39 8.5,68.43 13.2,68.43
  pour Top (no thermals): 13.2,60.31 8.5,60.31 8.5,57.39 13.2,57.39
HALL1_M1
  Top 0.61: U$1.H1 36.25,31.1 ANSCHLUSS_M1.3
HALL1_M2
  Top 0.61: ANSCHLUSS_M2.3 27.15,74.28 U$3.H1
HALL1_M3
  Bottom 0.61: U$4.H1 164.94,69.83 154.55,69.83 149.52,64.8 ANSCHLUSS_M3.3
HALL1_M4
  Top 0.813: U$5.H1 167.66,20.94 ANSCHLUSS_M4.3
HALL2_M1
  Top 0.61: U$1.H2 36.25,33.64 ANSCHLUSS_M1.2
HALL2_M2
  Bottom 0.61: ANSCHLUSS_M2.2 32.23,76.82 U$3.H2
HALL2_M3
  Top 0.61: U$4.H2 167.48,69.83 156.46,69.83 148.88,62.26 ANSCHLUSS_M3.2
HALL2_M4
  Bottom 0.813: U$5.H2 165.5,24.37 153.28,24.37 151.43,22.51 151.43,20.35 149.47,18.4 ANSCHLUSS_M4.2
HALL3_M1
  Top 0.61: U$1.H3 36.25,36.18 ANSCHLUSS_M1.1
HALL3_M2  (via drill 0.61)
  Top 0.61: ANSCHLUSS_M2.1 42.92,75.67 v33.52,75.67
  Bottom 0.61: v33.52,75.67 30.65,72.8 U$3.H3
HALL3_M3
  Top 0.61: U$4.H3 169.03,68.82 157.47,68.82 157.47,68.79 ANSCHLUSS_M3.1
HALL3_M4
  Bottom 0.813: U$5.H3 161.69,20.38 154.27,20.38 149.75,15.86 ANSCHLUSS_M4.1
HALL_SUPPLY_M1
  Top 0.813: U$1.+5V 33.71,26.02 ANSCHLUSS_M1.5
HALL_SUPPLY_M2
  Top 0.813: U$3.+5V 23.67,72.7 25.01,71.36 42.03,71.36 44.19,69.2 ANSCHLUSS_M2.5
HALL_SUPPLY_M3
  Bottom 0.813: U$4.+5V 163.44,70.87 149.39,70.87 ANSCHLUSS_M3.5
HALL_SUPPLY_M4
  Top 0.813: U$5.+5V 168.93,26.02 ANSCHLUSS_M4.5
K1
  Top 0.61: KNOPF-1.D KNOPF-1.B
  Bottom 0.61: KNOPF-1.D 179.95,57.5 U$2.3
K2
  Top 0.61: KNOPF-2.B KNOPF-2.D
  Bottom 0.61: KNOPF-2.B 182.49,57.35 U$2.2
K3
  Top 0.61: KNOPF-3.B KNOPF-3.D
  Bottom 0.61: KNOPF-3.D 189.48,63.85 189.48,57.13 U$2.0
M1_DIR  (via drill 0.61)
  Top 0.61: U$1.D_IN/D_OUT3 23.04,48.37 40,48.37 v43.68,52.05
  Bottom 0.61: U$2.32 131.69,54.85 129.98,53.13 65.56,53.13 64.49,52.05 v43.68,52.05
M2_DIR  (via drill 0.6, 0.61)
  Top 0.61: v96.77,51.23 67.09,51.23 63.27,55.05 v53.3,55.05 | v39.49,55.18 38.53,55.18 U$3.D_IN/D_OUT3
  Bottom 0.61: v96.77,51.23 97.15,51.61 133.46,51.61 135.81,53.96 135.88,53.96 136.77,54.85 U$2.30 | v39.49,55.18 53.18,55.18 v53.3,55.05
M3_DIR
  Top 0.61: U$2.1 183.76,53.96 178.68,53.96 177.35,52.63 177.35,51.72 175.14,49.51 U$4.D_IN/D_OUT3
M4_DIR
  Top 0.61: U$5.D_IN/D_OUT3 161.67,45.7 164.34,43.03 173.09,43.03 174.87,41.26 U$2.20
M5_FW  (via drill 0.61)
  Top 0.61: R28.2 41.47,60.31 v42.32,59.45 | v55.34,53.12 55.34,50.11 58.86,46.59 96.2,46.59 97.22,45.57 101.14,45.57 102.13,46.56 125.02,46.56 125.7,45.88 126.92,45.88 v127.75,45.04 | v168.65,51.92 169.79,53.07 U$2.7
  Bottom 0.61: v42.32,59.45 48.04,59.45 49.98,57.51 53.84,57.51 55.34,56.01 v55.34,53.12 | v127.75,45.04 142.46,45.04 143.82,46.4 145.33,46.4 150.74,51.8 168.52,51.8 v168.65,51.92
M5_RW  (via drill 0.61)
  Top 0.61: v57.68,57.54 57.68,59.01 48.76,67.93 39.17,67.93 R30.1 | v57.68,53.12 57.68,49.93 59.49,48.11 96.83,48.11 97.85,47.1 100.51,47.1 101.58,48.17 v126.15,48.17
  Bottom 0.61: v57.68,57.54 v57.68,53.12 | U$2.8 167.25,54.97 166.11,53.83 147.69,53.83 145.28,51.42 141.28,51.42 137.14,47.28 127.04,47.28 v126.15,48.17
MOTOR_EN  (1 unrouted)
  Top 0.61: U$4.D_IN2 172.05,49.51 170.66,50.91 145.34,50.91 144.89,51.36 136.83,51.36 134.23,53.96 U$2.31
  Bottom 0.61: 132.5,52.37 65.88,52.37 64.8,51.29 44.95,51.29 42.03,48.37 32.12,48.37 U$3.D_IN2 27.91,47.1 23.49,47.1 22.58,46.19 U$1.D_IN2 | U$5.D_IN2 166.06,47.61 171.06,47.61 172.22,48.77 U$4.D_IN2 | 132.96,52.81 134.23,54.08 U$2.31
N$2
  Top 3.048: MAIN.P$1 163.44,14.33 165.22,12.55 171.7,12.55 175.89,16.75 HAUPT1.2
N$5
  Top 1.27: R2.1 151.86,84.92 LED1.1
N$6
  Top 1.27: N$3855.C 190.11,44.77 U$2.VIN
N$43
  Top 0.61: R28.1 33.01,60.31 32.55,59.85 MOTOR1.P5
N$44
  Top 1.016: R27.1 33.65,62.34 32.16,60.85 MOTOR1.P6
N$45
  Top 1.016: R26.1 33.77,66.4 32.22,64.85 MOTOR1.P10
N$46
  Top 0.61: R29.1 36.25,63.86 33.14,63.86 32.12,62.85 MOTOR1.P8
N$47
  Top 0.61: R30.2 34.13,68.43 31.54,65.85 MOTOR1.P11
N$49
  Top 0.813: SCHUSS.1 39.62,82.15 37.33,84.44 28.95,84.44 26.92,82.4 10.91,82.4 7.23,78.72 7.23,69.58 3.68,66.02 3.68,59.54 7.37,55.85 MOTOR1.P30
  Top 1.016: MOTOR1.S2 15.99,60.85 MOTOR1.P25 | MOTOR1.S2 15.32,55.85 MOTOR1.P30 | MOTOR1.S2 20.99,55.85 MOTOR1.P1
N$50  (via drill 0.85)
  Top 0.813: v26.28,81.21 11.37,81.21 8.5,78.34 8.5,70.72 9.38,69.85 MOTOR1.P16
  Top 1.016: MOTOR1.P16 15.32,69.85 MOTOR1.S3 | MOTOR1.P15 30.29,69.83 22.53,69.83 19.71,67.01 MOTOR1.S3 | MOTOR1.S3 15.99,64.85 MOTOR1.P21
  Bottom 0.813: v26.28,81.21 29.51,84.44 39.74,84.44 42.16,82.02 SCHUSS.2
PHASE1_M1
  Bottom 1.27: U$1.MW1/+ 42.9,19.81 44.32,18.4 ANSCHLUSS_M1.8
PHASE1_M2
  Bottom 1.27: ANSCHLUSS_M2.8 35.43,61.58 34.41,62.59 34.41,65.26 32.25,67.42 15.57,67.42 U$3.MW1/+
PHASE1_M3
  Top 1.27: U$4.MW1/+ 151.9,76.29 150.7,77.5 ANSCHLUSS_M3.8
PHASE1_M4
  Top 1.27: U$5.MW1/+ 181.12,26.25 174.23,26.25 174.2,26.27 173.6,26.27 172.46,27.41 172.46,31.22 170.05,33.64 ANSCHLUSS_M4.8
PHASE2_M1
  Top 1.27: U$1.MW2/- 40.36,21.21 41.27,20.3 45.71,20.3 46.35,20.94 ANSCHLUSS_M1.7
PHASE2_M2
  Bottom 1.27: ANSCHLUSS_M2.7 46.09,63.61 38.07,63.61 32.84,68.84 21.58,68.84 20.92,68.84 16.73,68.84 U$3.MW2/-
PHASE2_M3
  Bottom 1.27: U$4.MW2/- 154.42,72.39 154.42,74.02 153.49,74.96 ANSCHLUSS_M3.7
PHASE2_M4
  Top 1.27: U$5.MW2/- 180.28,24.82 173.04,24.82 171.04,26.82 171.04,29.6 169.41,31.22 148.33,31.22 ANSCHLUSS_M4.7
PHASE3_M1
  Top 1.27: U$1.MW3/NC 40.13,24.82 45.84,24.82 47.19,23.48 ANSCHLUSS_M1.6
PHASE3_M2
  Bottom 1.27: ANSCHLUSS_M2.6 37.04,66.66 33.43,70.26 23.11,70.26 22.14,70.26 17.85,70.26 U$3.MW3/NC
PHASE3_M3
  Top 1.27: U$4.MW3/NC 155.42,70.47 150.76,70.47 148.81,72.42 ANSCHLUSS_M3.6
PHASE3_M4
  Bottom 1.27: U$5.MW3/NC 178.21,24.02 176.2,26.25 153.68,26.25 151.37,28.56 ANSCHLUSS_M4.6
PWM_M1  (via drill 0.61)
  Top 0.61: v98.93,50.64 98.43,50.15 66.66,50.15 v66.59,50.07 | v47.92,50.1 46.55,50.1 43.93,47.48 27.23,47.48 U$1.D_IN1
  Bottom 0.61: v98.93,50.64 99.13,50.84 134.93,50.84 U$2.29 | v66.59,50.07 47.95,50.07 v47.92,50.1
PWM_M2  (via drill 0.6)
  Top 0.61: v53.28,53.78 53.59,54.08 62.86,54.08 v65.91,51.04 | v98.8,48.85 99.81,48.85 100.98,50.02 127.63,50.02 v127.88,49.77
  Bottom 0.61: v65.91,51.04 94.44,51.04 96.5,48.98 98.67,48.98 v98.8,48.85 | v127.88,49.77 128.01,49.77 128.02,49.75 136.38,49.75 U$2.28 | v53.28,53.78 31.67,53.78 28.11,50.22 U$3.D_IN1
PWM_M3
  Bottom 0.61: U$4.D_IN1 169.68,51.13 172.38,53.83 176.01,53.83 U$2.4
PWM_M4
  Top 0.61: U$5.D_IN1 167.02,44.66 167.89,43.8 178.05,43.8 179.95,41.89 U$2.22
PWM_M5  (via drill 0.61)
  Top 0.61: R29.2 39.3,65.01 v40.89,65.01 | v48.09,65.42 50.12,65.42 56.51,59.04 v56.51,57.54 | v56.51,53.12 56.51,50.02 59.17,47.35 96.52,47.35 97.53,46.34 100.83,46.34 101.82,47.33 125.62,47.33 v126.1,46.84
  Bottom 0.61: v40.89,65.01 41.3,65.42 v48.09,65.42 | v56.51,57.54 v56.51,53.12 | v126.1,46.84 126.85,46.1 140.73,46.1 143.45,48.82 145.22,48.82 149.36,52.96 170.06,52.96 U$2.6
S0
  Top 0.61: U$2.39 147.19,39.73 IR.7 147.13,36.68 145.15,34.7 143.93,34.7 BODEN.9
S1
  Top 0.61: U$2.38 144.65,39.73 IR.6 144.59,36.68 142.61,34.7 141.39,34.7 BODEN.7
S2
  Top 0.61: U$2.37 142.11,39.73 IR.5 142.05,36.68 139.26,33.89 138.04,33.89 BODEN.5
S3
  Top 0.61: U$2.36 139.57,39.73 IR.4 139.57,36.05 138.17,34.65 136.26,34.65 BODEN.3
SCL  (via drill 0.61)
  Top 0.61: U$2.19 172.33,39.86 173.73,38.46 175.13,38.46 I2C_2.2 I2C_1.2 I2C_3.2 | v51.2,48.39 43.3,40.49 BNO055.SCL
  Bottom 0.61: U$2.19 172.33,41.38 169.92,43.8 127.38,43.8 123.28,47.89 96.51,47.89 95.65,48.75 51.55,48.75 v51.2,48.39
SDA
  Top 0.61: U$2.18 171.62,38.16 172.94,38.16 174.87,36.22 I2C_2.1 I2C_1.1 I2C_3.1
  Bottom 0.508: 144.89,41.38 144.87,41.37 143.65,41.37
  Bottom 0.61: U$2.18 168.39,41.38 144.89,41.38 | 143.65,41.37 142.11,42.91 126.99,42.91 122.8,47.1 49.24,47.1 BNO055.SDA
SIG_MUX0
  Bottom 0.61: BODEN.12 146.86,29.95 146.93,29.88 157.2,29.88 167.25,39.93 U$2.17
SIG_MUX1
  Bottom 0.61: BODEN.10 142.94,31.17 145.79,31.17 146.93,32.32 157.04,32.32 U$2.16
SIG_MUX2  (via drill 0.6)
  Top 0.61: BODEN.8 140,29.95 141.22,31.17 145.64,31.17 146.93,29.88 158.89,29.88 v158.95,29.93 | v164.08,35.16 164.08,38.08 U$2.15
  Bottom 0.61: v158.95,29.93 158.95,30.03 v164.08,35.16
SIG_MUX3  (via drill 0.6)
  Top 0.61: BODEN.6 139.31,27.29 161.03,27.29 162.43,28.68 v162.43,29.93 | v165.1,36.42 165.1,37.01 166.04,37.95 166.04,40.37 164.9,41.51 160.9,41.51 159.63,40.24 U$2.14
  Bottom 0.61: v165.1,36.42 165.04,36.36 165.04,34.76 162.43,32.15 v162.43,29.93
SIG_MUX4
  Top 0.61: IR.8 149.73,39.73 U$2.40
SIG_MUX5
  Top 0.61: IR.9 152.27,39.73 U$2.41
SPI_CS
  Bottom 0.61: FUNKMODUL.4 162.17,61.07 U$2.10
SPI_MISO
  Bottom 0.61: FUNKMODUL.2 157.09,61.07 U$2.12
SPI_MOSI
  Bottom 0.61: FUNKMODUL.3 159.63,58.53 U$2.11
VCC  (via drill 0.3)
  other vias: 7.1,63.35 6.22,64.37 7.1,64.37 7.99,64.37 7.1,65.39 7.99,65.39 6.22,65.39 5.33,65.39 5.33,64.37 5.33,63.35 6.22,63.35 7.99,63.35 7.99,62.34 7.1,62.34 6.22,62.34 5.33,62.34 5.33,61.32 6.22,61.32 7.1,61.32 7.99,61.32 7.99,60.31 7.1,60.31 6.22,60.31 5.33,60.31 22.73,65.51 23.61,65.51 24.5,65.51 25.39,65.51 22.73,64.5 23.61,64.5 24.5,64.5 25.39,64.5 22.73,63.48 23.61,63.48 24.5,63.48 25.39,63.48 22.73,62.47 23.61,62.47 24.5,62.47 25.39,62.47 22.73,61.45 23.61,61.45 24.5,61.45 25.39,61.45 22.73,60.43 23.61,60.43 24.5,60.43 25.39,60.43
  pour Top (rank 2, no thermals): -13.85,51.8 -13.85,75.42 3.68,92.95 8.63,97.9 189.6,97.9 210.18,77.32 210.18,9.51 194.56,-6.11 4.06,-6.11 -13.85,11.79
  pour Bottom (rank 4, no thermals): 3.68,66.53 26.92,66.53 26.92,59.16 3.68,59.16
WM
  Top 0.61: WM.1 167.03,36.18 168.46,37.61 168.46,40.49 166.68,42.27 159.35,42.27 157.09,40.01 U$2.13